# Altium schematic sheet USB3.0.SchDoc
size A3
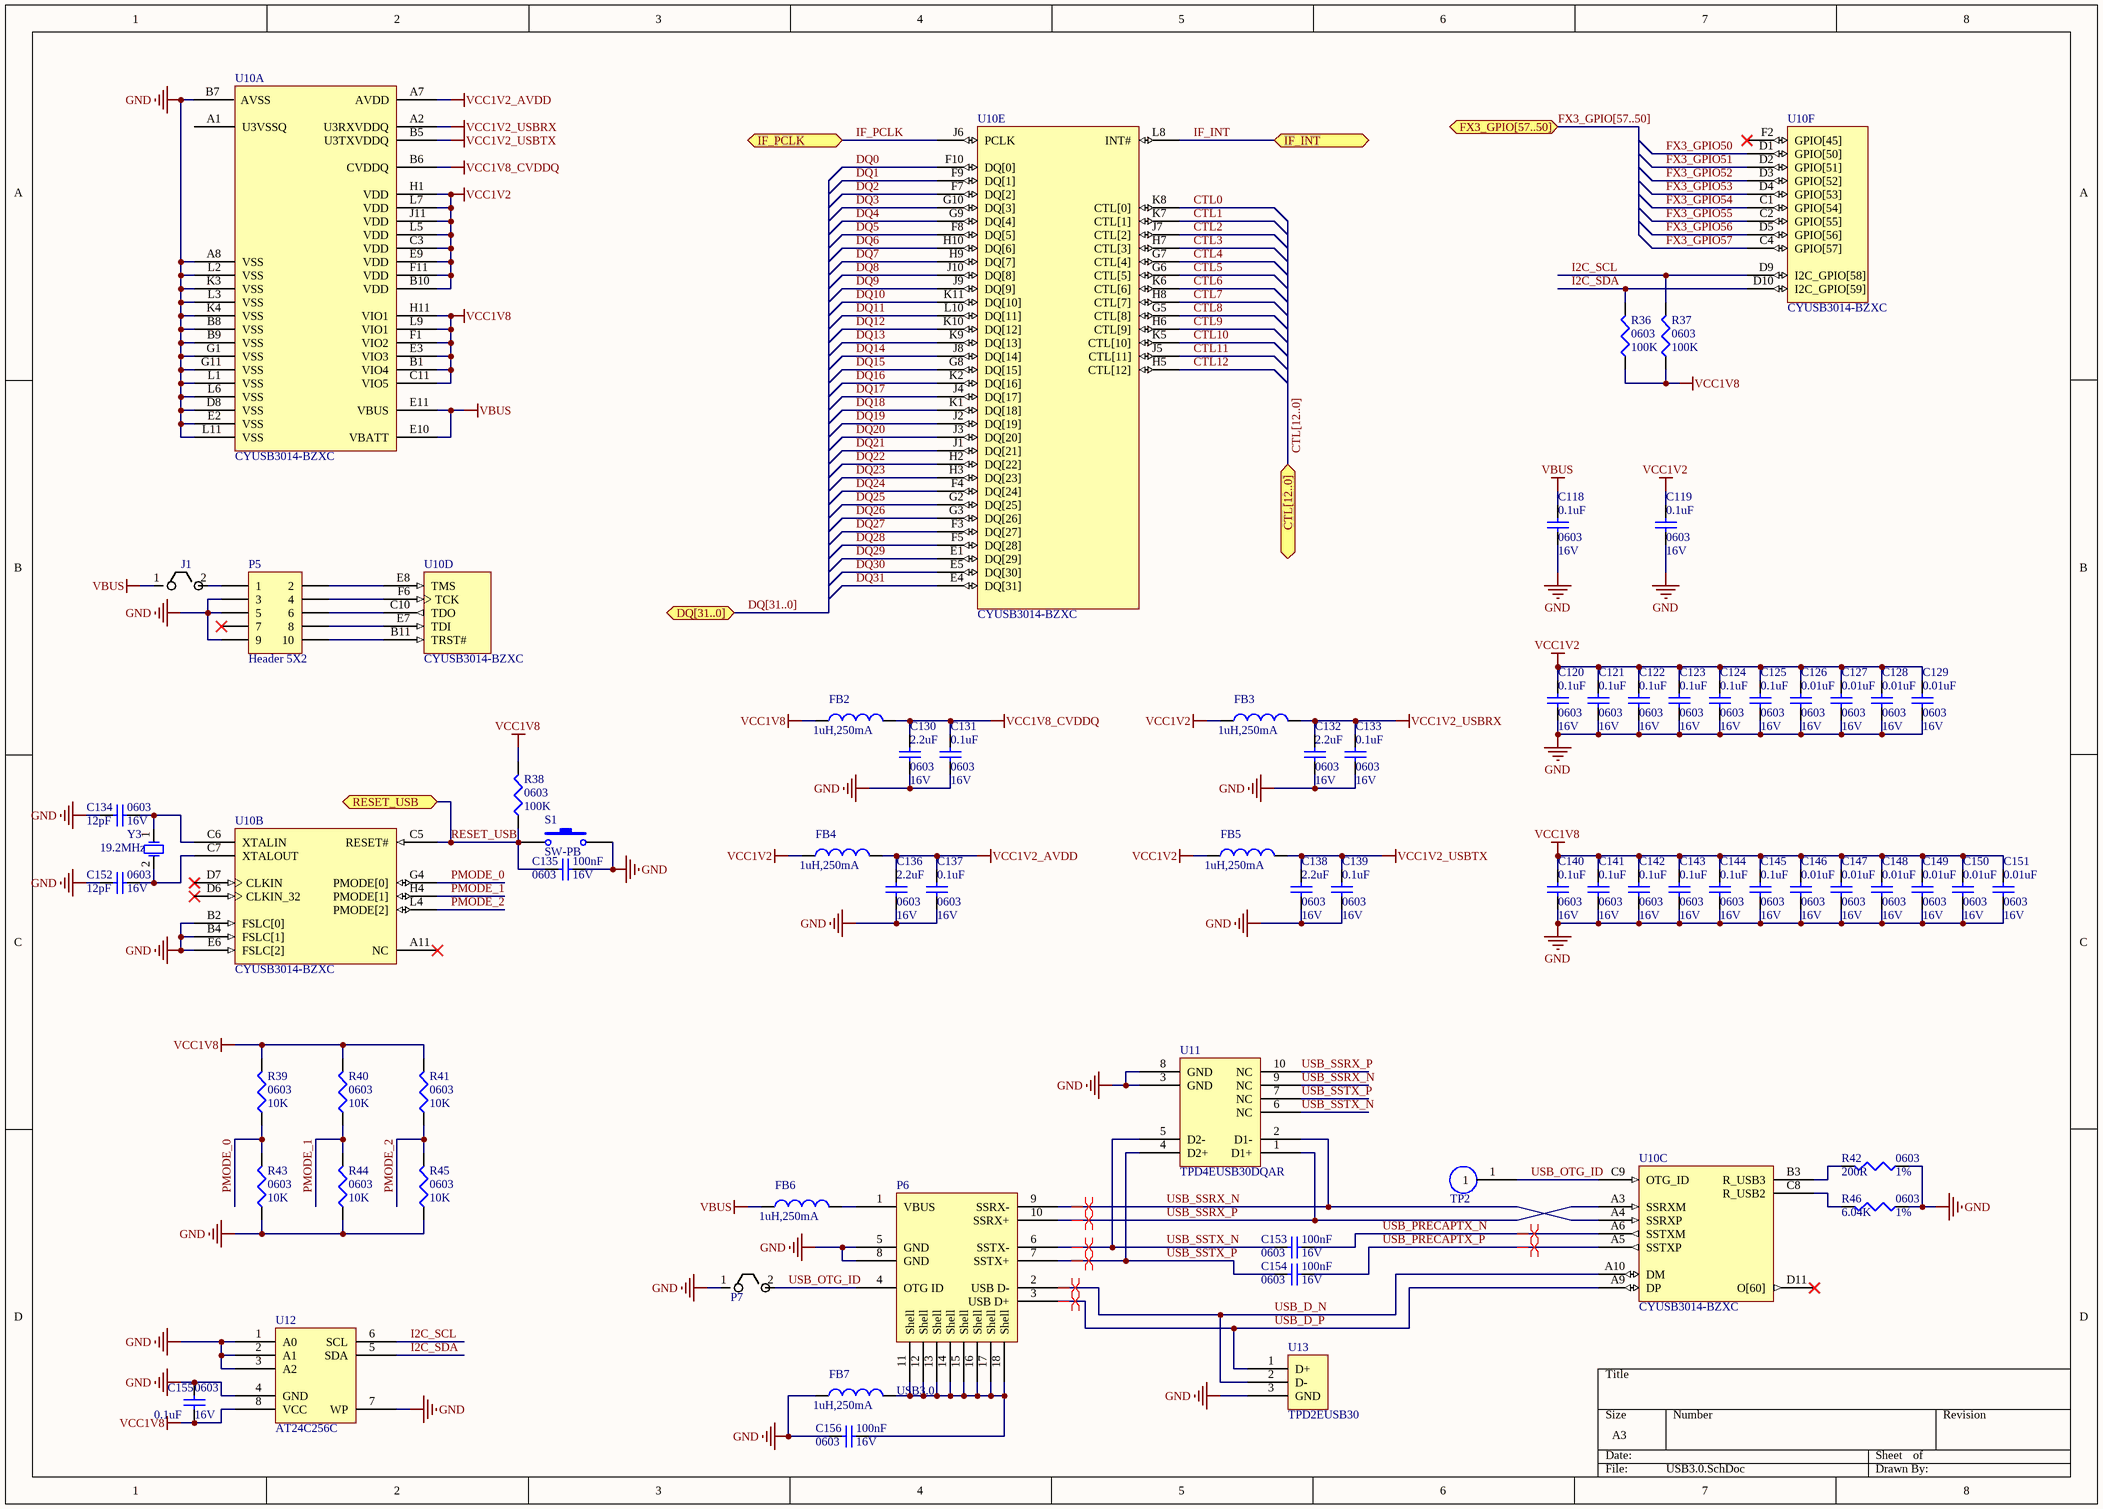
[diagram p0: USB3.0.SchDoc]

## Parts
C118  PackageReference: 0603  V: 16V  [1608[0603]]  (hidden comment: 0.1uF)
C119  PackageReference: 0603  V: 16V  [1608[0603]]  (hidden comment: 0.1uF)
C120  PackageReference: 0603  V: 16V  [1608[0603]]  (hidden comment: 0.1uF)
C121  PackageReference: 0603  V: 16V  [1608[0603]]  (hidden comment: 0.1uF)
C122  PackageReference: 0603  V: 16V  [1608[0603]]  (hidden comment: 0.1uF)
C123  PackageReference: 0603  V: 16V  [1608[0603]]  (hidden comment: 0.1uF)
C124  PackageReference: 0603  V: 16V  [1608[0603]]  (hidden comment: 0.1uF)
C125  PackageReference: 0603  V: 16V  [1608[0603]]  (hidden comment: 0.1uF)
C126  PackageReference: 0603  V: 16V  [1608[0603]]  (hidden comment: 0.01uF)
C127  PackageReference: 0603  V: 16V  [1608[0603]]  (hidden comment: 0.01uF)
C128  PackageReference: 0603  V: 16V  [1608[0603]]  (hidden comment: 0.01uF)
C129  PackageReference: 0603  V: 16V  [1608[0603]]  (hidden comment: 0.01uF)
C130  PackageReference: 0603  V: 16V  [1608[0603]]  (hidden comment: 2.2uF)
C131  PackageReference: 0603  V: 16V  [1608[0603]]  (hidden comment: 0.1uF)
C132  PackageReference: 0603  V: 16V  [1608[0603]]  (hidden comment: 2.2uF)
C133  PackageReference: 0603  V: 16V  [1608[0603]]  (hidden comment: 0.1uF)
C134  PackageReference: 0603  V: 16V  [1608[0603]]  (hidden comment: 12pF)
C135  PackageReference: 0603  V: 16V  [1608[0603]]  (hidden comment: 100nF)
C136  PackageReference: 0603  V: 16V  [1608[0603]]  (hidden comment: 2.2uF)
C137  PackageReference: 0603  V: 16V  [1608[0603]]  (hidden comment: 0.1uF)
C138  PackageReference: 0603  V: 16V  [1608[0603]]  (hidden comment: 2.2uF)
C139  PackageReference: 0603  V: 16V  [1608[0603]]  (hidden comment: 0.1uF)
C140  PackageReference: 0603  V: 16V  [1608[0603]]  (hidden comment: 0.1uF)
C141  PackageReference: 0603  V: 16V  [1608[0603]]  (hidden comment: 0.1uF)
C142  PackageReference: 0603  V: 16V  [1608[0603]]  (hidden comment: 0.1uF)
C143  PackageReference: 0603  V: 16V  [1608[0603]]  (hidden comment: 0.1uF)
C144  PackageReference: 0603  V: 16V  [1608[0603]]  (hidden comment: 0.1uF)
C145  PackageReference: 0603  V: 16V  [1608[0603]]  (hidden comment: 0.1uF)
C146  PackageReference: 0603  V: 16V  [1608[0603]]  (hidden comment: 0.01uF)
C147  PackageReference: 0603  V: 16V  [1608[0603]]  (hidden comment: 0.01uF)
C148  PackageReference: 0603  V: 16V  [1608[0603]]  (hidden comment: 0.01uF)
C149  PackageReference: 0603  V: 16V  [1608[0603]]  (hidden comment: 0.01uF)
C150  PackageReference: 0603  V: 16V  [1608[0603]]  (hidden comment: 0.01uF)
C151  PackageReference: 0603  V: 16V  [1608[0603]]  (hidden comment: 0.01uF)
C152  PackageReference: 0603  V: 16V  [1608[0603]]  (hidden comment: 12pF)
C153  PackageReference: 0603  V: 16V  [1608[0603]]  (hidden comment: 100nF)
C154  PackageReference: 0603  V: 16V  [1608[0603]]  (hidden comment: 100nF)
C155  PackageReference: 0603  V: 16V  [1608[0603]]  (hidden comment: 0.1uF)
C156  PackageReference: 0603  V: 16V  [1608[0603]]  (hidden comment: 100nF)
FB2  1uH,250mA  [2012[0805]]
FB3  1uH,250mA  [2012[0805]]
FB4  1uH,250mA  [2012[0805]]
FB5  1uH,250mA  [2012[0805]]
FB6  1uH,250mA  [2012[0805]]
FB7  1uH,250mA  [2012[0805]]
J1  DNP  [DNP]  (value not drawn)
P5  Header 5X2  [HDR2X5]
P6  USB3.0  [ZX360D-B-10P]
P7  DNP  [DNP]  (value not drawn)
R36  value 100K  PackageReference: 0603  [1608[0603]]  (hidden comment: Res3)
R37  value 100K  PackageReference: 0603  [1608[0603]]  (hidden comment: Res3)
R38  value 100K  PackageReference: 0603  [1608[0603]]  (hidden comment: Res3)
R39  value 10K  PackageReference: 0603  [1608[0603]]  (hidden comment: Res3)
R40  value 10K  PackageReference: 0603  [1608[0603]]  (hidden comment: Res3)
R41  value 10K  PackageReference: 0603  [1608[0603]]  (hidden comment: Res3)
R42  value 200R  PackageReference: 0603  ac: 1%  [1608[0603]]  (hidden comment: Res3)
R43  value 10K  PackageReference: 0603  [1608[0603]]  (hidden comment: Res3)
R44  value 10K  PackageReference: 0603  [1608[0603]]  (hidden comment: Res3)
R45  value 10K  PackageReference: 0603  [1608[0603]]  (hidden comment: Res3)
R46  value 6.04K  PackageReference: 0603  ac: 1%  [1608[0603]]  (hidden comment: Res3)
S1  SW-PB  [SPST-2]
TP2  TP  (value not drawn)
U10  CYUSB3014-BZXC  [CYUSB3014]  (parts A,B,C,D,E,F of 6)
U11  TPD4EUSB30DQAR  [TPD4EUSB30]
U12  AT24C256C  [AT24C256C[SOP8]]
U13  TPD2EUSB30  [TPE2USB30]
Y3  19.2MHz  [XTAL_A]

## Ports
CTL[12..0], DQ[31..0], FX3_GPIO[57..50], IF_INT, IF_PCLK, RESET_USB

## Nets
GND: C118.2 C119.2 C120.2 C121.2 C122.2 C123.2 C124.2 C125.2 C126.2 C127.2 C128.2 C129.2 C130.2 C131.2 C132.2 C133.2 C134.2 C135.2 C136.2 C137.2 C138.2 C139.2 C140.2 C141.2 C142.2 C143.2 C144.2 C145.2 C146.2 C147.2 C148.2 C149.2 C150.2 C151.2 C152.2 C155.2 C156.1 FB7.1 P5.3 P5.5 P5.9 P6.5(GND) P6.8(GND) P7.1 R42.1 R43.1 R44.1 R45.1 R46.1 S1.2 U10.A8(VSS) U10.B2(FSLC[0]) U10.B4(FSLC[1]) U10.B7(AVSS) U10.B8(VSS) U10.B9(VSS) U10.D8(VSS) U10.E2(VSS) U10.E6(FSLC[2]) U10.G1(VSS) U10.G11(VSS) U10.K3(VSS) U10.K4(VSS) U10.L1(VSS) U10.L2(VSS) U10.L3(VSS) U10.L6(VSS) U10.L11(VSS) U11.3(GND) U11.8(GND) U12.1(A0) U12.2(A1) U12.3(A2) U12.4(GND) U12.7(WP) U13.3(GND)
VBUS: C118.1 FB6.1 J1.1 U10.E10(VBATT) U10.E11(VBUS)
VCC1V2: C119.1 C120.1 C121.1 C122.1 C123.1 C124.1 C125.1 C126.1 C127.1 C128.1 C129.1 FB3.1 FB4.1 FB5.1 U10.B10(VDD) U10.C3(VDD) U10.E9(VDD) U10.F11(VDD) U10.H1(VDD) U10.J11(VDD) U10.L5(VDD) U10.L7(VDD)
VCC1V2_AVDD: C136.1 C137.1 FB4.2 U10.A7(AVDD)
VCC1V2_USBRX: C132.1 C133.1 FB3.2 U10.A2(U3RXVDDQ)
VCC1V2_USBTX: C138.1 C139.1 FB5.2 U10.B5(U3TXVDDQ)
VCC1V8: C140.1 C141.1 C142.1 C143.1 C144.1 C145.1 C146.1 C147.1 C148.1 C149.1 C150.1 C151.1 C155.1 FB2.1 R36.1 R37.1 R38.2 R39.2 R40.2 R41.2 U10.B1(VIO4) U10.C11(VIO5) U10.E3(VIO3) U10.F1(VIO2) U10.H11(VIO1) U10.L9(VIO1) U12.8(VCC)
VCC1V8_CVDDQ: C130.1 C131.1 FB2.2 U10.B6(CVDDQ)
CTL0: U10.K8(CTL[0])
CTL1: U10.K7(CTL[1])
CTL2: U10.J7(CTL[2])
CTL3: U10.H7(CTL[3])
CTL4: U10.G7(CTL[4])
CTL5: U10.G6(CTL[5])
CTL6: U10.K6(CTL[6])
CTL7: U10.H8(CTL[7])
CTL8: U10.G5(CTL[8])
CTL9: U10.H6(CTL[9])
CTL10: U10.K5(CTL[10])
CTL11: U10.J5(CTL[11])
CTL12: U10.H5(CTL[12])
DQ0: U10.F10(DQ[0])
DQ1: U10.F9(DQ[1])
DQ2: U10.F7(DQ[2])
DQ3: U10.G10(DQ[3])
DQ4: U10.G9(DQ[4])
DQ5: U10.F8(DQ[5])
DQ6: U10.H10(DQ[6])
DQ7: U10.H9(DQ[7])
DQ8: U10.J10(DQ[8])
DQ9: U10.J9(DQ[9])
DQ10: U10.K11(DQ[10])
DQ11: U10.L10(DQ[11])
DQ12: U10.K10(DQ[12])
DQ13: U10.K9(DQ[13])
DQ14: U10.J8(DQ[14])
DQ15: U10.G8(DQ[15])
DQ16: U10.K2(DQ[16])
DQ17: U10.J4(DQ[17])
DQ18: U10.K1(DQ[18])
DQ19: U10.J2(DQ[19])
DQ20: U10.J3(DQ[20])
DQ21: U10.J1(DQ[21])
DQ22: U10.H2(DQ[22])
DQ23: U10.H3(DQ[23])
DQ24: U10.F4(DQ[24])
DQ25: U10.G2(DQ[25])
DQ26: U10.G3(DQ[26])
DQ27: U10.F3(DQ[27])
DQ28: U10.F5(DQ[28])
DQ29: U10.E1(DQ[29])
DQ30: U10.E5(DQ[30])
DQ31: U10.E4(DQ[31])
FX3_GPIO50: U10.D1(GPIO[50])
FX3_GPIO51: U10.D2(GPIO[51])
FX3_GPIO52: U10.D3(GPIO[52])
FX3_GPIO53: U10.D4(GPIO[53])
FX3_GPIO54: U10.C1(GPIO[54])
FX3_GPIO55: U10.C2(GPIO[55])
FX3_GPIO56: U10.D5(GPIO[56])
FX3_GPIO57: U10.C4(GPIO[57])
I2C_SCL: R37.2 U10.D9(I2C_GPIO[58]) U12.6(SCL)
I2C_SDA: R36.2 U10.D10(I2C_GPIO[59]) U12.5(SDA)
IF_INT: U10.L8(INT#) ; port IF_INT
IF_PCLK: U10.J6(PCLK) ; port IF_PCLK
PMODE_0: R39.1 R43.2 U10.G4(PMODE[0])
PMODE_1: R40.1 R44.2 U10.H4(PMODE[1])
PMODE_2: R41.1 R45.2 U10.L4(PMODE[2])
RESET_USB: C135.1 R38.1 S1.1 U10.C5(RESET#) ; port RESET_USB
USB_D_N: P6.2(USB_D-) U10.A10(DM) U13.2(D-)
USB_D_P: P6.3(USB_D+) U10.A9(DP) U13.1(D+)
USB_OTG_ID: P6.4(OTG_ID) P7.2 TP2.1 U10.C9(OTG_ID)
USB_PRECAPTX_N: C153.2 U10.A6(SSTXM)
USB_PRECAPTX_P: C154.2 U10.A5(SSTXP)
USB_SSRX_N: P6.9(SSRX-) U10.A4(SSRXP) U11.2(D1-) U11.9(NC)
USB_SSRX_P: P6.10(SSRX+) U10.A3(SSRXM) U11.1(D1+) U11.10(NC)
USB_SSTX_N: C153.1 P6.6(SSTX-) U11.5(D2-) U11.6(NC)
USB_SSTX_P: C154.1 P6.7(SSTX+) U11.4(D2+) U11.7(NC)
NetC134_1: C134.1 U10.C6(XTALIN) Y3.1(OSC1)
NetC152_1: C152.1 U10.C7(XTALOUT) Y3.2(OSC2)
NetC156_2: C156.2 FB7.2 P6.11(Shell) P6.12(Shell) P6.13(Shell) P6.14(Shell) P6.15(Shell) P6.16(Shell) P6.17(Shell) P6.18(Shell)
NetFB6_2: FB6.2 P6.1(VBUS)
NetJ1_2: J1.2 P5.1
NetP5_2: P5.2 U10.E8(TMS)
NetP5_4: P5.4 U10.F6(TCK)
NetP5_6: P5.6 U10.C10(TDO)
NetP5_8: P5.8 U10.E7(TDI)
NetP5_10: P5.10 U10.B11(TRST#)
NetR42_2: R42.2 U10.B3(R_USB3)
NetR46_2: R46.2 U10.C8(R_USB2)

Not connected (* = marked no-connect by the designer): P5 7*; U10 A1(U3VSSQ) A11(NC)* D6(CLKIN_32)* D7(CLKIN)* D11(O[60])* F2(GPIO[45])*

## Buses and harness runs
bus CTL[12..0] = port CTL[12..0]
bus DQ[31..0] = port DQ[31..0]
bus FX3_GPIO[57..50] = port FX3_GPIO[57..50]

## Layout directives
differential pair: USB_D_N, USB_D_P, USB_PRECAPTX_N, USB_PRECAPTX_P, USB_SSRX_N, USB_SSRX_P, USB_SSTX_N, USB_SSTX_P

## Library data of the parts
C118-C156 = Cap Semi: Capacitor (Semiconductor SIM Model); LatestRevisionDate: 17-Jul-2002; LatestRevisionNote: Re-released for DXP Platform.; Publisher: Altium Limited
  C118-C125 C131 C133 C137 C139-C145 C155: Value: 0.1uF
  C126-C129 C146-C151: Value: 0.01uF
  C130 C132 C136 C138: Value: 2.2uF
  C134 C152: Value: 12pF
  C135 C153 C154 C156: Value: 100nF
FB2-FB7 = Inductor: Value: 1uH,250mA
P5 = Header 5X2: Header, 5-Pin, Dual row; LatestRevisionDate: 17-Jul-2002; LatestRevisionNote: Re-released for DXP Platform.; Publisher: Altium Limited
R36-R46 = Res3: Resistor; Published: 8-Jun-2000; LatestRevisionDate: 29-May-2009; LatestRevisionNote: IPC-7351 Footprint Added.; Publisher: Altium Limited; PackageDescription: Chip Resistor
S1 = SW-PB: Switch; Published: 24-Mar-1999; LatestRevisionDate: 17-Jul-2002; LatestRevisionNote: Re-released for DXP Platform.; PackageReference: SPST-2; Publisher: Altium Limited
U11 = TPD4EUSB30DQAR: 4-Channel ESD Protection for Super-Speed USB 3.0 Interface
Y3 = XTAL: Crystal Oscillator; Published: 8-Jun-2000; LatestRevisionDate: 17-Jul-2002; LatestRevisionNote: Re-released for DXP Platform.; PackageReference: R38; Publisher: Altium Limited; Value: 19.2MHz